# EAGLE schematic chipchestra-v01 (EAGLE 7.6.0)
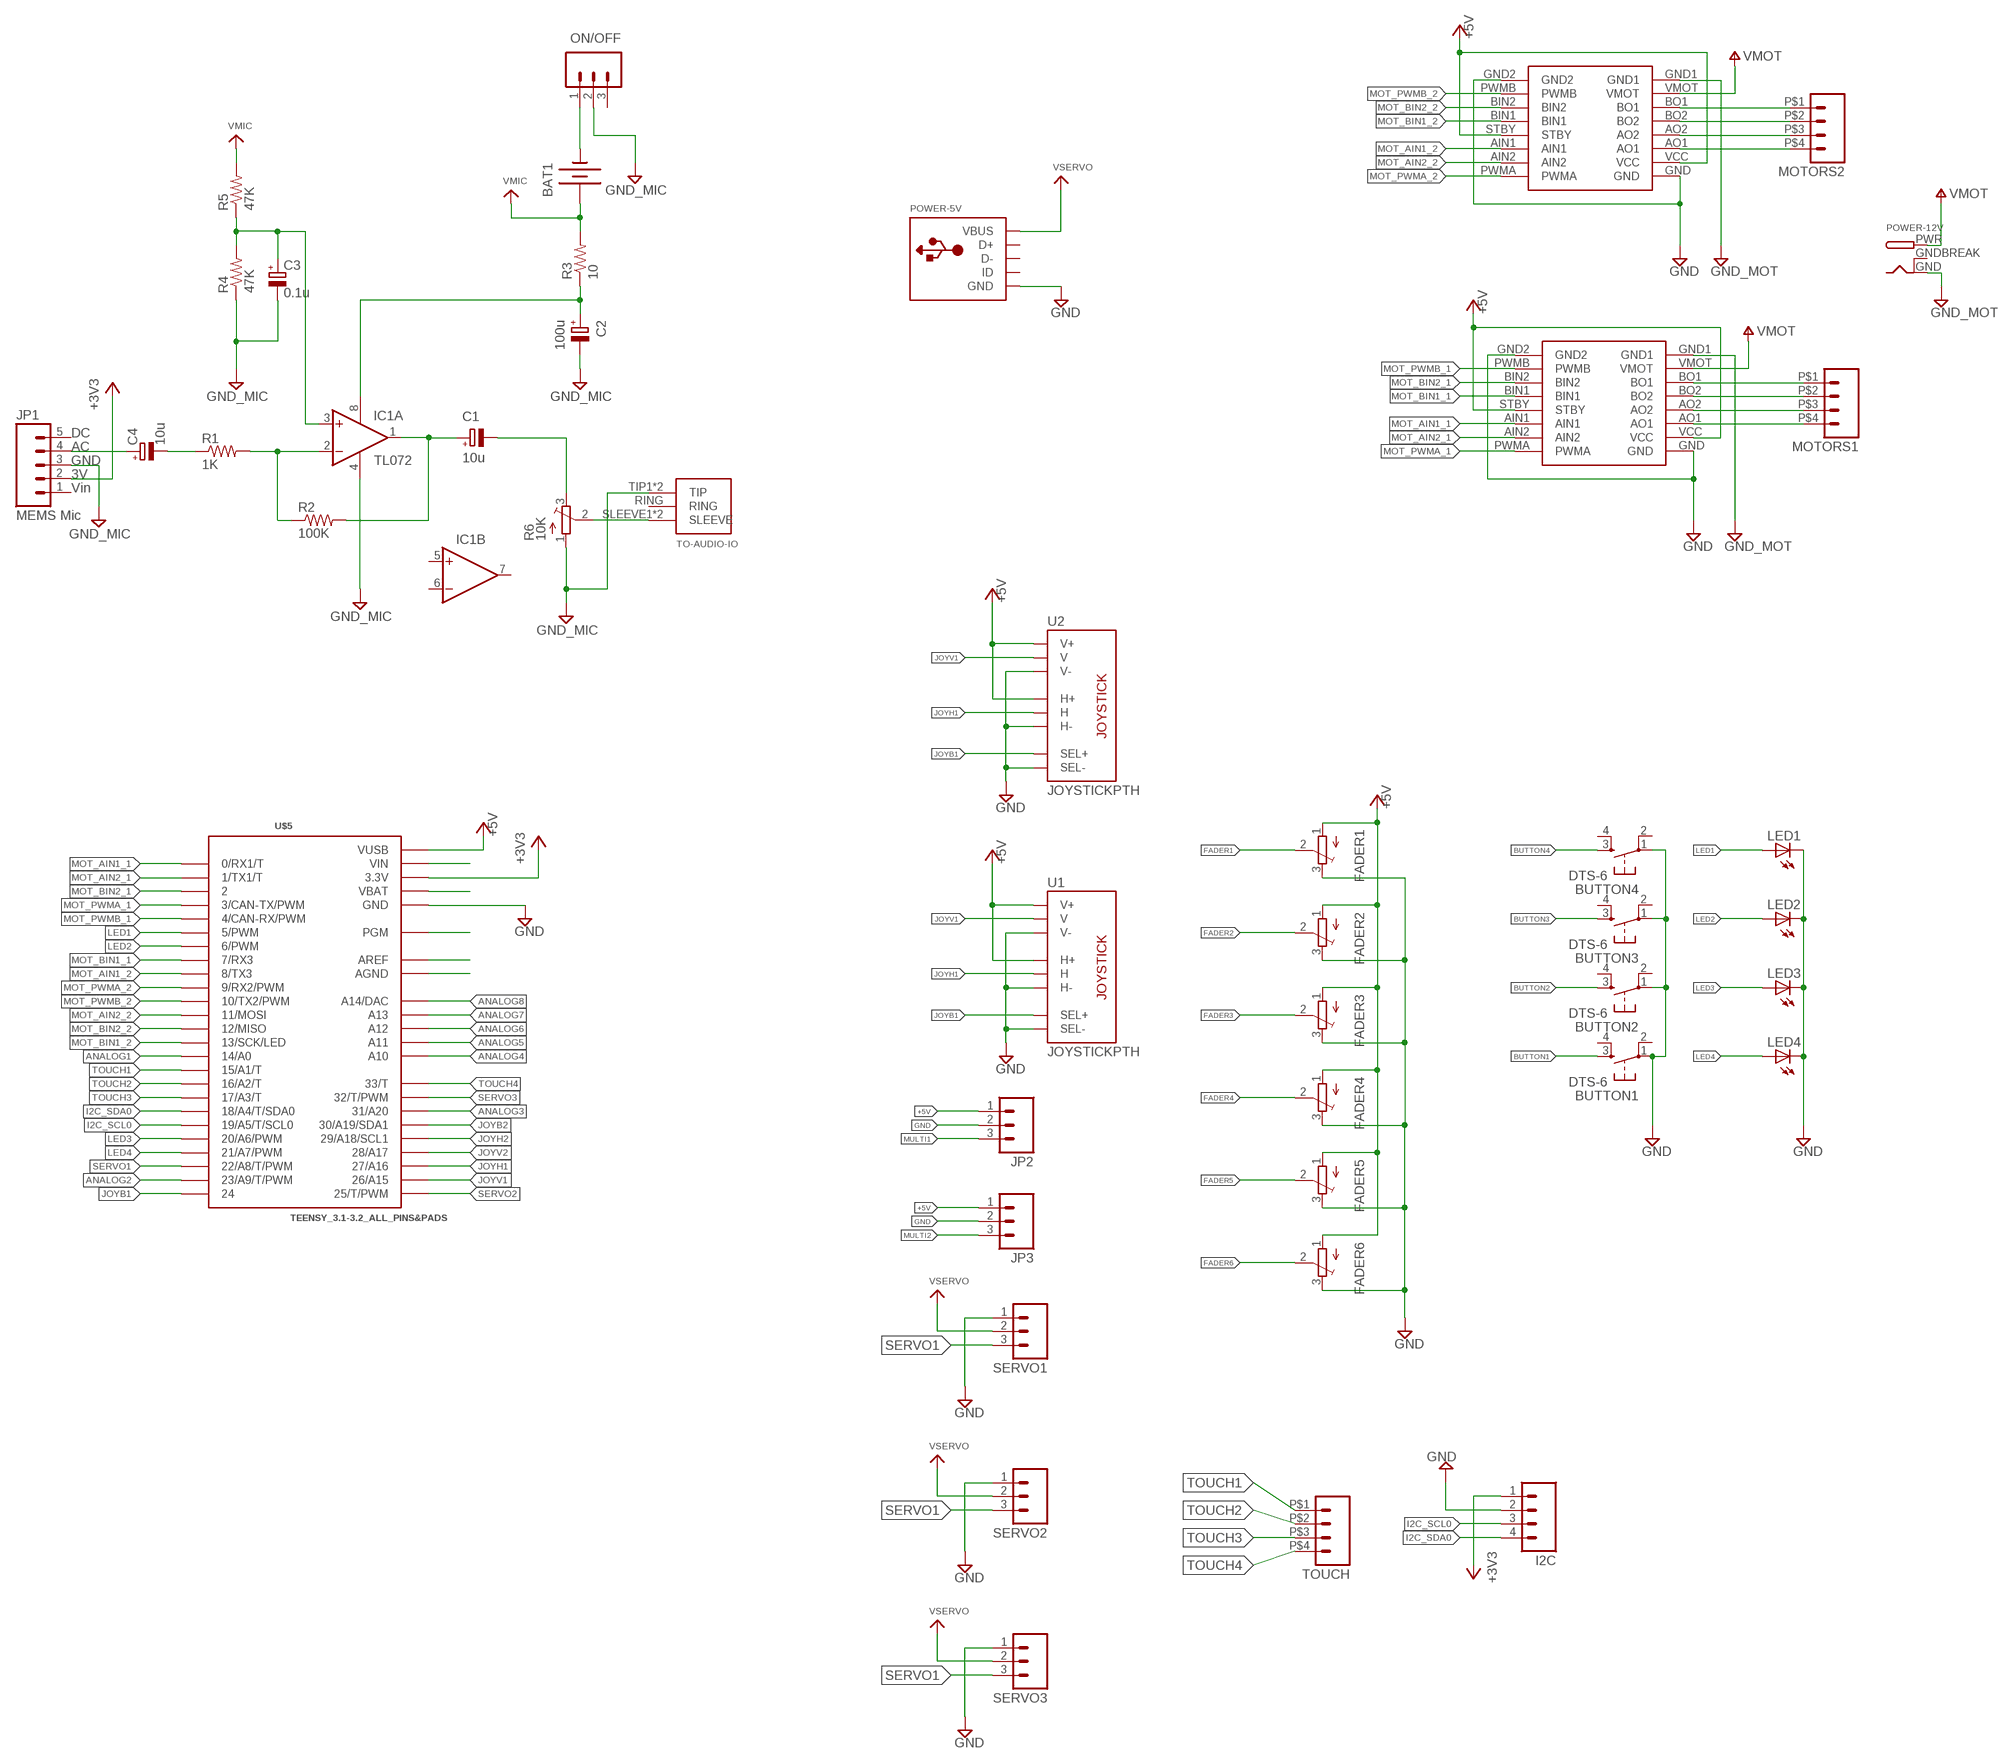
[diagram p0: schematic, sheet 1]

## Parts
BAT1  BATTERYA23  [BATTERY-A23]
BUTTON1  DTS-6  [DTS-6]
BUTTON2  DTS-6  [DTS-6]
BUTTON3  DTS-6  [DTS-6]
BUTTON4  DTS-6  [DTS-6]
C1  10u  CPOL-EUE2.5-5  [E2,5-5]
C2  100u  CPOL-EUE2.5-5  [E2,5-5]
C3  0.1u  CPOL-EUE2.5-5  [E2,5-5]
C4  10u  CPOL-EUE2.5-5  [E2,5-5]
FADER1  TRIMPOT3386  [TRIM-3386]
FADER2  TRIMPOT3386  [TRIM-3386]
FADER3  TRIMPOT3386  [TRIM-3386]
FADER4  TRIMPOT3386  [TRIM-3386]
FADER5  TRIMPOT3386  [TRIM-3386]
FADER6  TRIMPOT3386  [TRIM-3386]
I2C  M04LOCK  [1X04_LOCK]
IC1  OPA2134PA  [DIL08]
JP1  MEMS Mic  M05LOCK  [1X05_LOCK]
JP2  M03LOCK  [1X03_LOCK]
JP3  M03LOCK  [1X03_LOCK]
LED1  LED5MM  [LED5MM]
LED2  LED5MM  [LED5MM]
LED3  LED5MM  [LED5MM]
LED4  LED5MM  [LED5MM]
MOTORS1  M04  [SPRINGTERMINAL-2.54MM-4]
MOTORS2  M04  [SPRINGTERMINAL-2.54MM-4]
ON/OFF  labl  M03SINGLE-POLE-DOUBLE-THROW  [SPDT-SWITCH]
POWER-5V  USBMICRO_20329  [4UCONN_20329]
POWER-12V  DCBARRELPTH  [DCJACK_2MM_PTH]
R1  1K  R-US_0204/5  [0204/5]
R2  100K  R-US_0204/5  [0204/5]
R3  10  R-US_0204/5  [0204/5]
R4  47K  R-US_0204/5  [0204/5]
R5  47K  R-US_0204/5  [0204/5]
R6  10K  TRIMPOT3386  [TRIM-3386]
SERVO1  M03LOCK  [1X03_LOCK]
SERVO2  M03LOCK  [1X03_LOCK]
SERVO3  M03LOCK  [1X03_LOCK]
TO-AUDIO-IO  1/8"-F-STEREO-PCB  [1/8"-F-STEREO-PCB]
TOUCH  M04  [SPRINGTERMINAL-2.54MM-4]
U1  JOYSTICKPTH  [JOYSTICK]
U2  JOYSTICKPTH  [JOYSTICK]
U$5  TEENSY_3.1-3.2_ALL_PINS&PADS  [TEENSY_3.0-3.2_ALL_PINS_&_PADS]
U$6  POLOLU_TB6612FNG  [POLOLU_TB6612FNG]
U$7  POLOLU_TB6612FNG  [POLOLU_TB6612FNG]

## Nets
+3V3: I2C.1 JP1.2 U$5.3.3V U$5.3.3V1(3.3V) U$5.3.3V2(3.3V)
+5V: FADER1.1(A) FADER2.1(A) FADER3.1(A) FADER4.1(A) FADER5.1(A) FADER6.1(A) JP2.1 JP3.1 U1.H1(H+) U1.V1(V+) U2.H1(H+) U2.V1(V+) U$5.VUSB U$6.STBY U$6.VCC U$7.STBY U$7.VCC
ANALOG1: U$5.14/A0
ANALOG2: U$5.23/A9(23/A9/T/PWM)
ANALOG3: U$5.31(31/A20)
ANALOG4: U$5.A10
ANALOG5: U$5.A11
ANALOG6: U$5.A12
ANALOG7: U$5.A13
ANALOG8: U$5.RESET/DAC(A14/DAC)
BUTTON1: BUTTON1.3
BUTTON2: BUTTON2.3
BUTTON3: BUTTON3.3
BUTTON4: BUTTON4.3
FADER1: FADER1.2(S)
FADER2: FADER2.2(S)
FADER3: FADER3.2(S)
FADER4: FADER4.2(S)
FADER5: FADER5.2(S)
FADER6: FADER6.2(S)
GND: BUTTON1.1 BUTTON2.1 BUTTON3.1 BUTTON4.1 FADER1.3(E) FADER2.3(E) FADER3.3(E) FADER4.3(E) FADER5.3(E) FADER6.3(E) I2C.2 JP2.2 JP3.2 LED1.K(C) LED2.K(C) LED3.K(C) LED4.K(C) POWER-5V.BASE@1(GND) POWER-5V.BASE@2(GND) POWER-5V.GND POWER-5V.SPRT@1(GND) POWER-5V.SPRT@2(GND) POWER-5V.SPRT@3(GND) POWER-5V.SPRT@4(GND) SERVO1.1 SERVO2.1 SERVO3.1 U1.B2A(SEL-) U1.H3(H-) U1.V3(V-) U2.B2A(SEL-) U2.H3(H-) U2.V3(V-) U$5.GND U$5.GND1(GND) U$5.GND2(GND) U$6.GND U$6.GND2 U$7.GND U$7.GND2
GND_MIC: C2.- C3.- IC1.4(A:V-) JP1.3 R4.1 R6.1(A) TO-AUDIO-IO.TIP1(TIP) TO-AUDIO-IO.TIP2(TIP)
GND_MOT: POWER-12V.GND U$6.GND1 U$7.GND1
I2C_SCL0: I2C.3 U$5.19/A5(19/A5/T/SCL0)
I2C_SDA0: I2C.4 U$5.18/A4(18/A4/T/SDA0)
JOYB1: U1.B1A(SEL+) U2.B1A(SEL+) U$5.24
JOYB2: U$5.30(30/A19/SDA1)
JOYH1: U1.H2(H) U2.H2(H) U$5.27(27/A16)
JOYH2: U$5.29(29/A18/SCL1)
JOYV1: U1.V2(V) U2.V2(V) U$5.26(26/A15)
JOYV2: U$5.28(28/A17)
LED1: LED1.A U$5.5(5/PWM)
LED2: LED2.A U$5.6(6/PWM)
LED3: LED3.A U$5.20/A6(20/A6/PWM)
LED4: LED4.A U$5.21/A7(21/A7/PWM)
MOT_AIN1_1: U$5.0(0/RX1/T) U$7.AIN1
MOT_AIN1_2: U$5.8(8/TX3) U$6.AIN1
MOT_AIN2_1: U$5.1(1/TX1/T) U$7.AIN2
MOT_AIN2_2: U$5.11(11/MOSI) U$6.AIN2
MOT_BIN1_1: U$5.7(7/RX3) U$7.BIN1
MOT_BIN1_2: U$5.13(13/SCK/LED) U$6.BIN1
MOT_BIN2_1: U$5.2 U$7.BIN2
MOT_BIN2_2: U$5.12(12/MISO) U$6.BIN2
MOT_PWMA_1: U$5.3(3/CAN-TX/PWM) U$7.PWMA
MOT_PWMA_2: U$5.9(9/RX2/PWM) U$6.PWMA
MOT_PWMB_1: U$5.4(4/CAN-RX/PWM) U$7.PWMB
MOT_PWMB_2: U$5.10(10/TX2/PWM) U$6.PWMB
MULTI1: JP2.3
MULTI2: JP3.3
N$1: C2.+ IC1.8(A:V+) R3.1
N$2: BAT1.GND@1(-) ON/OFF.1
N$3: C4.+ JP1.4
N$4: C4.- R1.1
N$5: IC1.2(A:-IN) R1.2 R2.1
N$6: C1.- R6.3(E)
N$7: R6.2(S) TO-AUDIO-IO.SLEEVE1(SLEEVE) TO-AUDIO-IO.SLEEVE2(SLEEVE)
N$8: C3.+ IC1.3(A:+IN) R4.2 R5.1
N$9: C1.+ IC1.1(A:OUT) R2.2
N$10: U$5.VBAT
N$13: ON/OFF.2 ; supply symbol labelled GND_MIC
N$14: POWER-5V.VBUS ; supply symbol labelled VSERVO
N$45: MOTORS1.P$1 U$7.BO1
N$46: MOTORS1.P$2 U$7.BO2
N$48: U$5.VIN
N$52: MOTORS1.P$3 U$7.AO2
N$53: U$5.PGM
N$54: MOTORS1.P$4 U$7.AO1
N$55: U$5.AREF
N$56: U$5.AGND
N$57: MOTORS2.P$1 U$6.BO1
N$63: MOTORS2.P$2 U$6.BO2
N$64: MOTORS2.P$3 U$6.AO2
N$65: MOTORS2.P$4 U$6.AO1
SERVO1: SERVO1.3 SERVO2.3 SERVO3.3 U$5.22/A8(22/A8/T/PWM)
SERVO2: U$5.25(25/T/PWM)
SERVO3: U$5.32(32/T/PWM)
TOUCH1: TOUCH.P$1 U$5.15/A1(15/A1/T)
TOUCH2: TOUCH.P$2 U$5.16/A2(16/A2/T)
TOUCH3: TOUCH.P$3 U$5.17/A3(17/A3/T)
TOUCH4: TOUCH.P$4 U$5.33(33/T)
V+: U$6.VMOT U$7.VMOT
VBAT: SERVO1.2 SERVO2.2 SERVO3.2 ; supply symbol labelled VSERVO
VMIC: BAT1.PWR@1(+) R3.2 R5.2
VMOT: POWER-12V.PWR ; supply symbol labelled V+
Unconnected: BUTTON1.2 BUTTON1.4 BUTTON2.2 BUTTON2.4 BUTTON3.2 BUTTON3.4 BUTTON4.2 BUTTON4.4 IC1.5(B:+IN) IC1.6(B:-IN) IC1.7(B:OUT) JP1.1 JP1.5 ON/OFF.3 POWER-5V.D+ POWER-5V.D- POWER-5V.ID TO-AUDIO-IO.RING

## Power pins joined to a net without a drawn wire
GNDBREAK: POWER-12V.GNDBREAK

## Library data of the parts
BAT1 = Daniel:BATTERY: Battery Holders Various common sizes : AA, AAA, 18650 (PRT-12895), 20mm coin cell and 12mm coin cell. 20MM_4LEGS, BATT-10373
BUTTON1-BUTTON4 = switch-tact:DTS-6
C1-C4 = rcl:CPOL-EU: POLARIZED CAPACITOR, European symbol
FADER1-FADER6 R6 = adafruit:TRIMPOT: SMT trimmer potentiometer part number TC33X http://www.ladyada.net/library/eagle
I2C MOTORS1 MOTORS2 TOUCH = CMU-ArtFab:M04: Header 4 Standard 4-pin 0.1" header. Use with straight break away headers (SKU : PRT-00116), right angle break away headers (PRT-00553), swiss pins (PRT-00743), machine pins (PRT-00117), and female headers (PRT-00115). Molex polarized connector foot print use with SKU : PRT-08231 with associated crimp pins and housings. 1MM SMD Version SKU: PRT-10208
IC1 = linear:OPA2*: Dual Operational Amplifier Low Power, Single-Supply, Rail-To-Rail Operational Amplifier Source: http://focus.ti.com/lit/ds/symlink/opa2345.pdf http://focus.ti.com .. opa241.pdf http://focus.ti.com/lit/ds/symlink/opa2134.pdf; IC_NAME: TL072
JP1 = SparkFun-Connectors:M05: Header 5 Standard 5-pin 0.1" header. Use with straight break away headers (SKU : PRT-00116), right angle break away headers (PRT-00553), swiss pins (PRT-00743), machine pins (PRT-00117), and female headers (PRT-00115). Molex polarized connector foot print use with SKU : PRT-08230 with associated crimp pins and housings.; CON1: Vin; CON2: 3V; CON3: GND; CON4: AC; CON5: DC
JP2 JP3 SERVO1-SERVO3 = SparkFun-Connectors:M03: Header 3 Standard 3-pin 0.1" header. Use with straight break away headers (SKU : PRT-00116), right angle break away headers (PRT-00553), swiss pins (PRT-00743), machine pins (PRT-00117), and female headers (PRT-00115). Molex polarized connector foot print use with SKU : PRT-08232 with associated crimp pins and housings.
LED1-LED4 = adafruit:LED: LED OSRAM: - CHIPLED LG R971, LG N971, LY N971, LG Q971, LY Q971, LO R971, LY R971 LH N974, LH R974 LS Q976, LO Q976, LY Q976 LO Q996 - Hyper CHIPLED LW Q18S LB Q993, LB Q99A, LB R99A - SideLED LS A670, LO A670, LY A670, LG A670, LP A670 LB A673, LV A673, LT A673, LW A673 LH A674 LY A675 LS A676, LA A676, LO A676, LY A676, LW A676 LS A679, LY A679, LG A679 - Hyper Micro SIDELED® LS Y876, LA Y876, LO Y876, LY Y876 LT Y87S - SmartLED LW L88C, LW L88S LB L89C, LB L89S, LG L890 LS L89K, LO L89K, LY L89K LS L896, LA L896, LO L896, LY L896 - TOPLED LS T670, LO T670, LY T670, LG T670, LP T670 LSG T670, LSP T670, LSY T670, LOP T670, LYG T670 LG T671, LOG T671, LSG T671 LB T673, LV T673, LT T673, LW T673 LH T674 LS T676, LA T676, LO T676, LY T676, LB T676, LH T676, LSB T676, LW T676 LB T67C, LV T67C, LT T67C, LS T67K, LO T67K, LY T67K, LW E67C LS E67B, LA E67B, LO E67B, LY E67B, LB E67C, LV E67C, LT E67C LW T67C LS T679, LY T679, LG T679 LS T770, LO T770, LY T770, LG T770, LP T770 LB T773, LV T773, LT T773, LW T773 LH T774 LS E675, LA E675, LY E675, LS T675 LS T776, LA T776, LO T776, LY T776, LB T776 LHGB T686 LT T68C, LB T68C - Hyper Mini TOPLED® LB M676 - Mini TOPLED Santana® LG M470 LS M47K, LO M47K, LY M47K Source: http://www.osram.convergy.de/
ON/OFF = Daniel:M03: Single Pole Double Throw Switch 2.0mm pitch 3-pin header for switch.
POWER-5V = microbuilder:USB: USB Connectors USBMINIB - Surface Mount Female Mini-B USB Connector 4UConnector: 06564
POWER-12V = adafruit:DCBARREL: 2.0mm DC Barrel Jack DCJACK_2MM_PTH - Through Hole Jack (4UConnector: 05537)
R1-R5 = CMU-ArtFab:R-US_: RESISTOR, American symbol
TO-AUDIO-IO = CMU-ArtFab:1/8"-F-STEREO-PCB; TO-AUDIO-IO: TO-AUDIO-IO
U1 U2 = adafruit:JOYSTICK: Thumb Joystick Joystick commonly found in PS2 controllers. Two pots and a select switch. Adapted from Sparkfun Library (but for more common 6mm switch sticks)
U$5 = Teensy_3_and_LC_Series_Boards_v1.4:TEENSY_3.1-3.2_ALL_PINS&PADS: Footprint for Teensy 3.1 or 3.2 board using all pads and all through-holes. Pads need a 2x7 0.1" SMD header.
U$6 U$7 = CMU-ArtFab:POLOLU_TB6612FNG

## Net classes
0 default: width 0.152 mm, clearance 0.152 mm
1 GND: width 0.508 mm, clearance 0.152 mm
2 Power: width 0.508 mm, clearance 0.152 mm